# EAGLE design Gun_Del_Sol_3 (EAGLE 9.6.2)
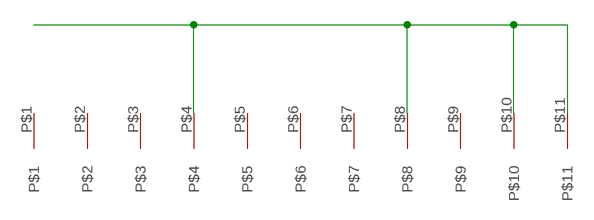
[diagram p0: schematic, sheet 1]

## Parts
U$1  ADVCHIP  [ADCHIP]

## Nets
N$1: U$1.P$4 U$1.P$8 U$1.P$10 U$1.P$11
Unconnected: U$1.P$1 U$1.P$2 U$1.P$3 U$1.P$5 U$1.P$6 U$1.P$7 U$1.P$9

## Library data of the parts
U$1 = advpins:ADVCHIP

## Board
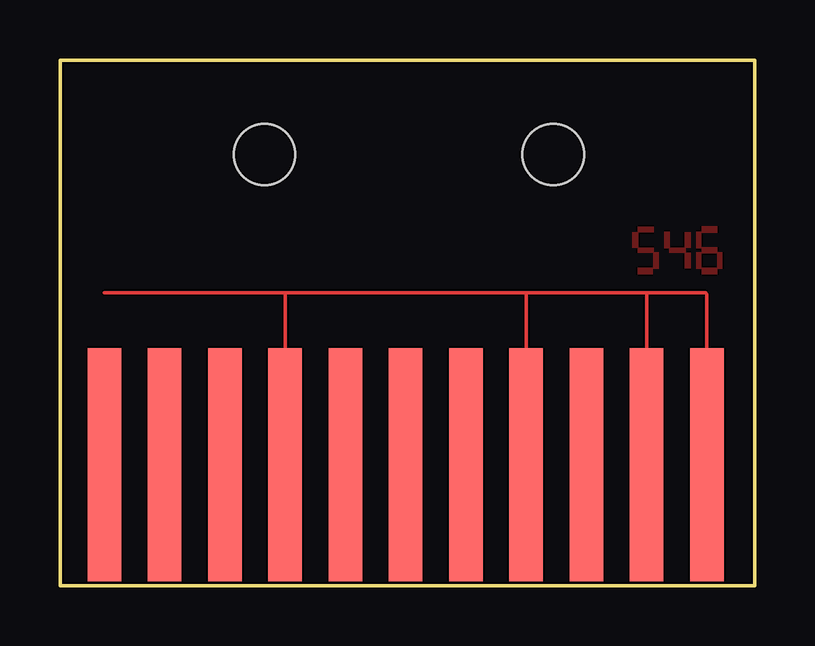
[diagram p1: board, top side]

Size 28.95 x 21.9 mm. Coordinates in mm from the lower left corner, seen from the top.
Outline: 0.05,0 28.95,0 28.95,21.9 0.05,21.9
Outline: 0,0 0,21.9
Copper layers (1*16): Top 0.035mm / dielectric 1.5mm / Bottom 0.035mm
Design rules "default *": minimum track width 6mil, minimum drill 0.35mm, track to track 0.25mil, track to pad 6mil, pad to pad 6mil, via to via 6mil, smd to smd 6mil, copper to edge 0.002540625mm, drill to drill 1mil, minimum pad ring 10mil, minimum via ring 8mil, stop-mask expansion 4mil, vias tented up to drill 0mil, thermal gap 10mil
Holes 2.56 mm at 8.52,17.96 20.55,17.96

### Footprints (pad centres in the part's own frame; a part is rotated, then mirrored left to right if it is on the bottom)
ADCHIP = smd 1.4 x 9.7: P$1 -27.61,5.02; P$2 -25.1,5.02; P$3 -22.59,5.02; P$4 -20.08,5.02; P$5 -17.57,5.02; P$6 -15.06,5.02; P$7 -12.55,5.02; P$8 -10.04,5.02; P$9 -7.53,5.02; P$10 -5.02,5.02; P$11 -2.51,5.02

### Placement (x,y rotation side)
U$1  29.46,0.02 0 top

### Tracks (layer width: path | path; a pad name or v marks a point on that pad's centre or on a via)
N$1
  Top 0.152: 1.85,12.2 9.41,12.2 | 9.41,12.2 19.44,12.2 | 19.44,12.2 24.45,12.2 | 24.45,12.2 26.9,12.2 26.95,12.15 U$1.P$11 | U$1.P$4 9.38,12.17 9.41,12.2 | U$1.P$8 19.42,12.18 19.44,12.2 | U$1.P$10 24.44,12.19 24.45,12.2
N$2
  pour Top: 24.07,13.21 24.07,13 24.71,13 24.71,13.21
N$3
  pour Top: 24.07,14.08 23.86,14.08 23.86,14.73 24.07,14.73
N$4
  pour Top: 24.71,13.86 24.08,13.86 24.08,14.08 24.71,14.08
N$5
  pour Top: 25.19,14.73 25.19,14.08 25.4,14.08 25.4,14.73
N$6
  pour Top: 26.27,13.21 26.05,13.21 26.05,13.86 26.27,13.86
N$7
  pour Top: 26.04,13.86 25.41,13.86 25.41,14.08 26.04,14.08
N$8
  pour Top: 26.73,14.95 26.73,14.73 27.38,14.73 27.38,14.95
N$9
  pour Top: 26.52,14.73 26.52,14.08 26.73,14.08 26.73,14.73
N$10
  pour Top: 26.73,14.08 26.73,13.86 27.38,13.86 27.38,14.08
N$11
  pour Top: 27.39,13.86 27.39,13.21 27.6,13.21 27.6,13.86
N$12
  pour Top: 26.52,13.86 26.52,13.21 26.73,13.21 26.73,13.86
N$13
  pour Top: 24.72,13.86 24.72,13.21 24.94,13.21 24.94,13.86
N$14
  pour Top: 24.72,14.73 24.09,14.73 24.09,14.95 24.72,14.95
N$24
  pour Top: 26.27,14.08 26.05,14.08 26.05,14.73 26.27,14.73
N$36
  pour Top: 26.73,13.21 26.73,13 27.38,13 27.38,13.21